# Altium schematic sheet SCH_LiBoBattery.SchDoc
size A; SheetNumber: 1; SheetTotal: 1
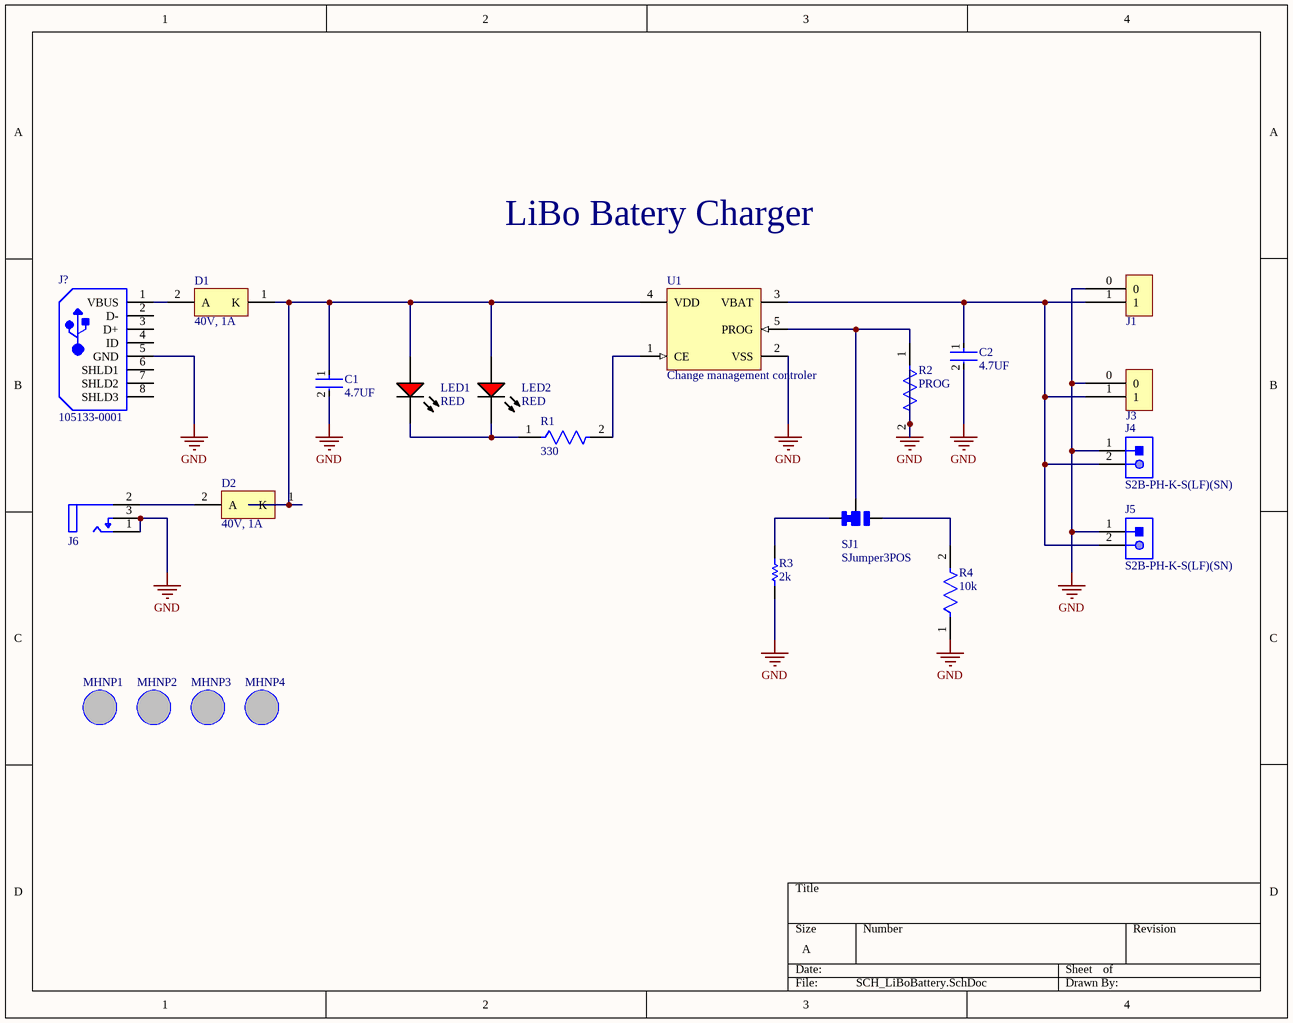
[diagram p0: SCH_LiBoBattery.SchDoc]

## Parts
C1  4.7UF  [FP-CC0805-0_85-MFG]
C2  4.7UF  [FP-CC0805-0_85-MFG]
D1  40V, 1A  [ONSC-SMA-2-403D-02_V]
D2  40V, 1A  [ONSC-SMA-2-403D-02_V]
J1  1-79276-2  [PCBComponent_1]  (value not drawn)
J3  1-79276-2  [PCBComponent_1]  (value not drawn)
J4  S2B-PH-K-S(LF)(SN)  [JST-S2B-PH-K-S_V]
J5  S2B-PH-K-S(LF)(SN)  [JST-S2B-PH-K-S_V]
J6  CONN PWR JACK 2.1X5.5MM SOLDER  [FP-RASM722PTR13X-MFG]  (value not drawn)
J?  105133-0001  [MOLX-105133-0001_V]
LED1  RED  [VISH-TLMS1000_V]
LED2  RED  [VISH-TLMS1000_V]
MHNP1  Mounting Hole Non-plated 3.2mm  (value not drawn)
MHNP2  Mounting Hole Non-plated 3.2mm  (value not drawn)
MHNP3  Mounting Hole Non-plated 3.2mm  (value not drawn)
MHNP4  Mounting Hole Non-plated 3.2mm  (value not drawn)
R1  330  [FP-CRCW0805-e3-MFG]
R2  PROG  [FP-CFR50J2K2-MFG]
R3  2k  [RESC2013X70X40ML20T20]
R4  10k  [FP-RN732A-MFG]
SJ1  SJumper3POS  [SJumper3POS-Footprint-1]
U1  Change management controler  [SOT-23-OT5_M]

## Nets
GND: C1.2 C2.2 J1.0 J3.0 J4.1 J5.1 J6.1(TIP_TERMINAL(CENTER_PIN)) J6.3(SHUNT_TERMINAL) J?.5(GND) R2.2 R3.1 R4.1 U1.2(VSS)
NetC1_1: C1.1 D1.1(K) D2.1(K) LED1.1(A) LED2.1(A) U1.4(VDD)
NetC2_1: C2.1 J1.1 J3.1 J4.2 J5.2 U1.3(VBAT)
NetD1_2: D1.2(A) J?.1(VBUS)
NetD2_2: D2.2(A) J6.2(SLEEVE_TERMINAL)
NetLED1_2: LED1.2(K) LED2.2(K) R1.1
NetR1_2: R1.2 U1.1(CE)
NetR2_1: R2.1 SJ1.2 U1.5(PROG)
NetR3_2: R3.2 SJ1.1
NetR4_2: R4.2 SJ1.3

Not connected (* = marked no-connect by the designer): J? 2(D-) 3(D+) 4(ID) 6(SHLD1) 7(SHLD2) 8(SHLD3)

## Notes on the sheet
- LiBo Batery Charger

## Library data of the parts
C1 C2 = CMP-03422-001342-1: CAP CER 4.7UF 6.3V X7R 0805; Manufacturer: Yageo; Manufacturer Part Number: CC0805KKX7R5BB475; Tolerance: 0.1; Material: Ceramic; Automotive: No; Temperature Characteristic: X7R; Package: CC0805-0.85; Value: 4.7 uF; Capacitance: 4.7 uF; Voltage Rating: 6.3 V; Octopart: https://octopart.com/cc0805kkx7r5bb475-yageo-27548069; Category: Cap; Digikey Description: CAP CER 4.7UF 6.3V X7R 0805; Device Class L3: Ceramic Capacitors; Temperature: -30°C to +85°C; ComponentLink2URL: http://www.yageo.com/documents/recent/UPY-GPHC_Y5V_6.3V-to-50V_8.pdf; Mouser Description: Multilayer Ceramic Capacitors MLCC - SMD/SMT 4.7uF 6.3V X7R 10%; Temperature Range High: +85°C; RoHS: TRUE; Device Class L2: Capacitors; ComponentLink2Description: Datasheet; Height: 0.95mm; Device Class L1: Passive Components; Ipc Land Pattern Name: CAPC200125X85; Lead Free: Yes; Temperature Range Low: -30°C; Footprint Url: http://www.yageo.com/exep/pages/download/literatures/UPY-C_GEN_24.pdf
D1 D2 = CMP-1055-00320-1: Schottky Power Rectifier, 2-Pin SMA, Pb-Free, Tape and Reel; PartNumber: MBRA140T3G; Manufacturer: On Semiconductor; Configuration: Single; IFSM Max (A): 30; PackageReference: SMA-2-403D-02; PackageDescription: 2-Pin Small Molded Package, J-Bend Lead, Body 2.605 x 4.315 mm; RoHS: TRUE; ComponentLink1Description: Manufacturer URL; Packing: Tape and Reel; ComponentLink3URL: http://www.onsemi.com/pub_link/Collateral/403D-02.PDF; ComponentLink2Description: Datasheet; ComponentLink2URL: http://www.onsemi.cn/pub_link/Collateral/MBRA140T3-D.PDF; DatasheetVersion: Rev. 10; ComponentLink1URL: http://www.onsemi.com/; ComponentLink3Description: Package Specification; Mounting Technology: Surface Mount; PackageVersion: Rev. G, 07/2012
J1 J3 = 1-79276-2: Manufacture: TE conectivity; Supplier 1: DigiKey; Supplier Part Number 1: A29545-ND
J4 J5 = CMP-1755-00004-1: Male Header, Pitch 2 mm, 1 x 2 Position, Height 4.8 mm, Tail Length 3.4 mm, -25 to 85 degC, RoHS, Bulk; Case\Package: Radial; Tolerance: 20%; Capacitance: 10 uF; Voltage Rating (DC): 50 V; Packaging: Bulk; ComponentLink1URL: http://www.jst-mfg.com/product/pdf/eng/ePH.pdf; Radiation Hardening: No; Height: 11 mm; Package Quantity: 200; PackageDescription: Male Header, Pitch 2 mm, 1 x 2 Position, Height 4.8 mm, Tail Length 3.4 mm; PackageReference: S2B-PH-K-S; Diameter: 5 mm; Pins: 2; Mount: Through Hole; Max Operating Temperature: 85 degC; Min Operating Temperature: -40 degC; ComponentLink1Description: Datasheet; DatasheetVersion: Dec-12; Length: 11 mm; Lead Pitch: 2 mm; REACH SVHC: No SVHC; Voltage Rating: 50 V; RoHSCompliant: true
J6 = CMP-47995-000002-1: Shielding: Unshielded; Gender: Male; Current Rating: 5A; Termination: Solder; Contact Material: Copper Alloy; Package Quantity: 120; Case/Package: SMD/SMT; Contact Plating: Tin; Connector Type: Jack; Housing Material: Thermoplastic; Mount: Surface Mount; Housing Color: Black; Color: Black
J? = CMP-2000-05829-1: Micro-USB B Receptacle, Vertical, -30 to 85 degC, 5-Pin SMD, RoHS, Tape and Reel; Manufacturer: Molex; Package Version: Rev. C, 11/2015; Voltage Rating: 30VAC; Connector Type: MicroUSBTypeBReceptacle; Current Rating: 1.8A; Number of Ports: 1; Voltage - Max: 30V; Mounting Style: SMD/SMT; Packaging: Reel; Product: MicroUSBTypeBConnectors; Contact Plating: Gold; Flammability Rating: UL94V-0; Package Description: 5-Pin Surface Mount Device, Pitch 0.65 mm; Package Reference: 105133-0001; Contact Material: CopperAlloy; Mounting Angle: Vertical; RoHS: Details; Manufacturer URL: http://www.molex.com/; Factory Pack Quantity: 6000; PartNumber: 105133-0001; Standard: USB; Brand: Molex; Series: 105133; Product Category: USBConnectors; Termination Style: SolderTail; Gender: Receptacle; Package URL: http://www.molex.com/pdm_docs/sd/1051330001_sd.pdf; Datasheet Version: 03/2016; Color: Black; Datasheet URL: http://www.molex.com/webdocs/datasheets/pdf/en-us/1051330001_IO_CONNECTORS.pdf; Mounting Technology: SurfaceMount
LED1 LED2 = CMP-2000-07254-1: Low Current LED, 40 mW, 1.8 V, -40 to 100 degC, 2-Pin SMD (0603), RoHS, Tape and Reel; Manufacturer: Vishay; Lens Shape: Rectangular; Automotive Qualification Standard: AEC-Q100; Wavelength Typ: 636nm; SVHC: ToBeAdvised; Bulb Size: 1.6mmx0.8mm; Forward Voltage: 1.8V; Luminous Intensity: 4mcd; Forward Current If: 2mA; Viewing Angle: 80°; Datasheet Version: Rev. 1.7, 02/2011; Datasheet URL: https://datasheet.ciiva.com/5798/1698881-5798337.pdf; LED Mounting: SMD; Packaging: CutTape; Package Reference: TLMS1000; Manufacturer URL: http://www.vishay.com/; Mounting Technology: SurfaceMount; Product Range: -; LED Colour: Red; Package Description: 2-Pin Surface Mount Device, Body 1.6 x 0.8 mm; MSL: MSL2-1year
MHNP1-MHNP4 = MTH3P2MM: Mounting Hole Non-plated 3.2mm Drill hole
R1 = CMP-2001-03823-2: RES Thick Film, 330Ω, 1%, 0.125W, 100ppm/°C, 0805; Voltage Rating (DC): 150V; Resistance: 330R; Max Power Dissipation: 125mW; Mount: Surface Mount; Packaging: Tape and Reel; Min Operating Temperature: -55°C; Military Standard: Not; Case Code (Metric): 2012; Height: 0.02inch; Voltage Rating: 150V; Case/Package: 0805; Max Operating Temperature: 155°C; Width: 0.049inch; Case Code (Imperial): 0805; Termination: SMD/SMT; Lead Free: Lead Free; Contact Plating: Tin; Package Quantity: 10; Composition: Thick Film; Length: 2mm; Features: Automotive AEC-Q200; Depth: 1.25mm; Weight: 0.000194oz; Tolerance: 1%; Power Rating: 125mW; Number of Terminations: 2; Temperature Coefficient: 100ppm/°C
R2 = CMP-03212-000011-1: RES 2.2K OHM 5% 1/2W AXIAL; Temperature Coefficient: 0ppm/°C; Max Power Dissipation: 500mW; Resistance: 2.2kR; Number of Resistors: 1; Voltage Rating (DC): 350V; Case/Package: Axial; Number of Terminations: 2; REACH SVHC: No SVHC; Mount: Axial; Packaging: Cut Tape; Min Operating Temperature: -55°C; Series: CFR50, Neohm; Resistor Type: Thin Film; Tolerance: 5%; Radiation Hardening: No; Package Quantity: 3000; Power Rating: 500mW; Length: 9mm; Termination: Axial; Max Operating Temperature: 155°C; ELV: Compliant; Voltage Rating: 350V; Resistance Tolerance: 5%; Technology: CARBON FILM; Diameter: 3mm; RoHS Compliant: Yes
R3 = CMP-2001-00370-1: Part Number: ERJ-6GEYJ202V; Manufacturer: Panasonic
R4 = CMP-03211-001029-1: SMD Chip Resistor, Thin Film, 10KΩ, 100 V, 0805 [2012 Metric], 100 mW, 0.1%, RN73 Series; Manufacturer Part Number: RN73C2A10KBTG; Manufacturer: TE Connectivity; Temperature Coefficient: 10ppm/°C; Voltage Rating: 100V; Power Rating: 0.1W; Value: 10KΩ; Composition: Thin Film; Package: RN732A; Device Class L2: Resistors; Device Class L1: Passive Components; ComponentLink2Description: Datasheet; Category: Res; Lead Free: Yes; Height: 0.65mm; packaging: 250 cut tape length; Temperature Range High: 155°C; Temperature: -55°C to 155°C; Tolerance: 0.1%; Octopart: https://octopart.com/rn73c2a10kbtg-te+connectivity-21411919; Temperature Range Low: -55°C; Device Class L3: Chip SMD Resistors; Resistance: 10KΩ; Series: RN73; RoHS: TRUE; ComponentLink2URL: https://www.te.com/commerce/DocumentDelivery/DDEController?Action=showdoc&DocId=Data+Sheet%7F1773270%7FP%7Fpdf%7FEnglish%7FENG_DS_1773270_P.pdf%7F1676162-2; Ipc Land Pattern Name: RESC200125X55; Automotive: No; octopart_url: https://octopart.com/rn73c2a10kbtg-te+connectivity-21411919
SJ1 = CMP-00000-1: Sjumper
U1 = CMP-0133-00139-1: Simple, Miniature Single-Cell, Fully Integrated Li-Ion/Li-Polymer Charge Management Controller, 4.2V, 5-Pin SOT-23, Industrial Temperature, Tape and Reel; Code_IPC: SOT23-5; PackageDescription: 5-Lead Plastic Small Outline Transistor (OT) [SOT-23]; PackageVersion: revBB, Aug-2009; DatasheetVersion: revB, Sep-2007; PackageReference: SOT-23-OT5